# EAGLE design DAU_Kupplung_3phasig_V1_10 (EAGLE 6.1)
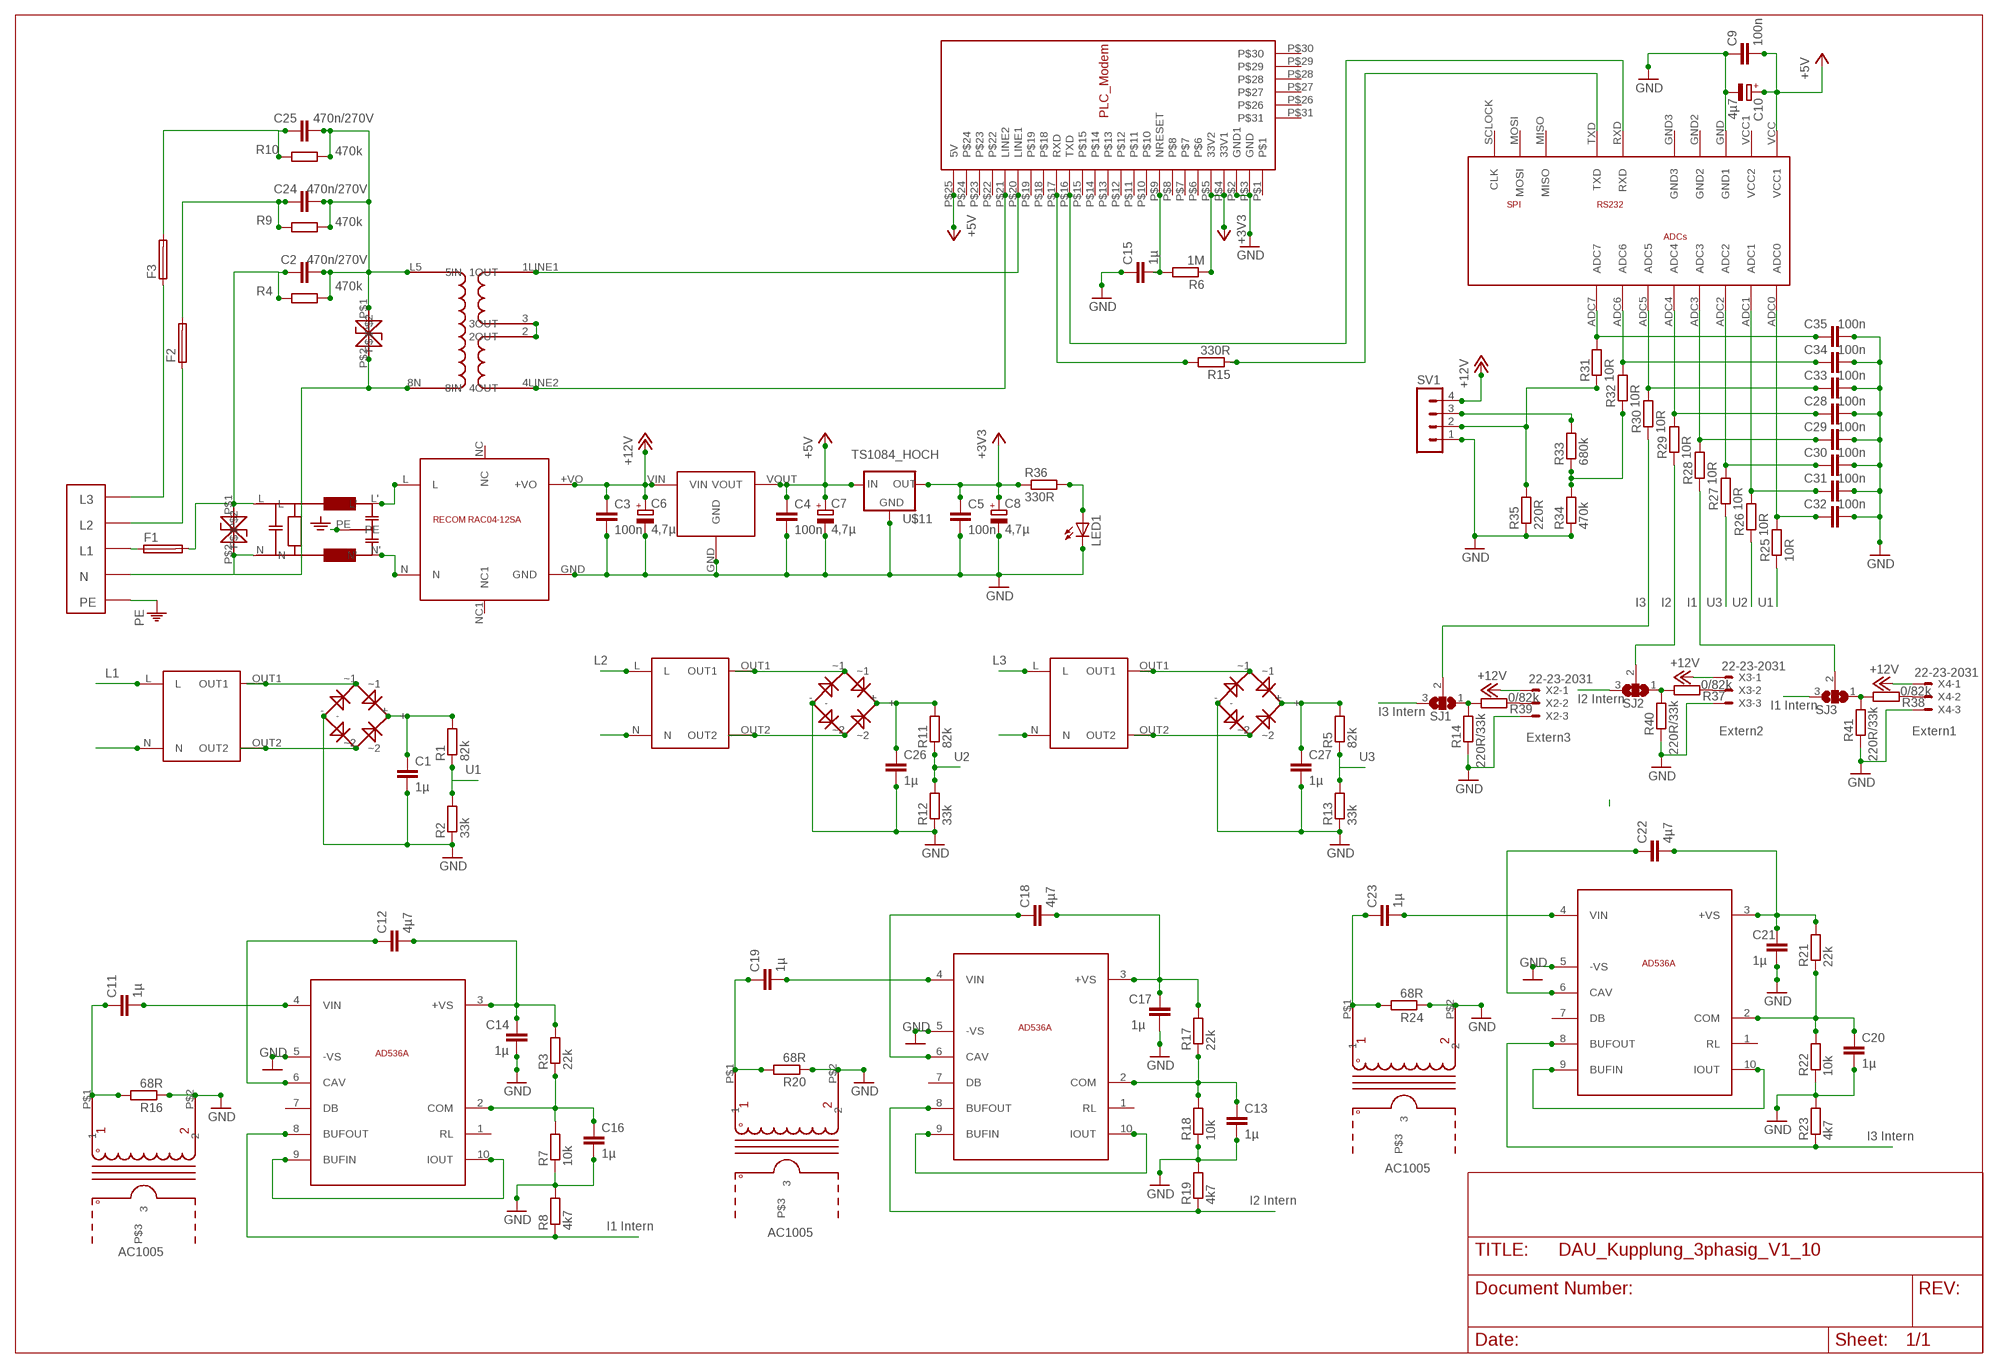
[diagram p0: schematic, sheet 1]

## Parts
AC1002_1  AC1010  [AC1010]
C1  1µ  C-EUC0805K  [C0805K]
C2  470n/270V  C-EU225-087X268  [C225-087X268]
C3  100n  C-EUC0805K  [C0805K]
C4  100n  C-EUC0805K  [C0805K]
C5  100n  C-EUC0805K  [C0805K]
C6  4,7µ  CPOL-EUE2.5-6  [E2,5-6]
C7  4,7µ  CPOL-EUE2.5-6  [E2,5-6]
C8  4,7µ  CPOL-EUE2.5-6  [E2,5-6]
C9  100n  C-EUC0805K  [C0805K]
C10  4µ7  CPOL-EUE2,5-6E  [E2,5-6E]
C11  1µ  C-EUC0805K  [C0805K]
C12  4µ7  C-EUC0805K  [C0805K]
C13  1µ  C-EUC0805K  [C0805K]
C14  1µ  C-EUC0805K  [C0805K]
C15  1µ  C-EUC0805K  [C0805K]
C16  1µ  C-EUC0805K  [C0805K]
C17  1µ  C-EUC0805K  [C0805K]
C18  4µ7  C-EUC0805K  [C0805K]
C19  1µ  C-EUC0805K  [C0805K]
C20  1µ  C-EUC0805K  [C0805K]
C21  1µ  C-EUC0805K  [C0805K]
C22  4µ7  C-EUC0805K  [C0805K]
C23  1µ  C-EUC0805K  [C0805K]
C24  470n/270V  C-EU225-087X268  [C225-087X268]
C25  470n/270V  C-EU225-087X268  [C225-087X268]
C26  1µ  C-EUC0805K  [C0805K]
C27  1µ  C-EUC0805K  [C0805K]
C28  100n  C-EUC0805K  [C0805K]
C29  100n  C-EUC0805K  [C0805K]
C30  100n  C-EUC0805K  [C0805K]
C31  100n  C-EUC0805K  [C0805K]
C32  100n  C-EUC0805K  [C0805K]
C33  100n  C-EUC0805K  [C0805K]
C34  100n  C-EUC0805K  [C0805K]
C35  100n  C-EUC0805K  [C0805K]
F1  TR5  [TR5]
F2  TR5  [TR5]
F3  TR5  [TR5]
LED1  LEDSQR2X5  [LED2X5]
P6KE300CA  P6KE300CA  TSV  [TSV]
R1  82k  R-EU_R0805  [R0805]
R2  33k  R-EU_R0805  [R0805]
R3  22k  R-EU_R0805  [R0805]
R4  470k  R-EU_0204/7  [0204/7]
R5  82k  R-EU_R0805  [R0805]
R6  1M  R-EU_R0805  [R0805]
R7  10k  R-EU_R0805  [R0805]
R8  4k7  R-EU_R0805  [R0805]
R9  470k  R-EU_0204/7  [0204/7]
R10  470k  R-EU_0204/7  [0204/7]
R11  82k  R-EU_R0805  [R0805]
R12  33k  R-EU_R0805  [R0805]
R13  33k  R-EU_R0805  [R0805]
R14  220R/33k  R-EU_R0805  [R0805]
R15  330R  R-EU_R0805  [R0805]
R16  68R  R-EU_0204/7  [0204/7]
R17  22k  R-EU_R0805  [R0805]
R18  10k  R-EU_R0805  [R0805]
R19  4k7  R-EU_R0805  [R0805]
R20  68R  R-EU_0204/7  [0204/7]
R21  22k  R-EU_R0805  [R0805]
R22  10k  R-EU_R0805  [R0805]
R23  4k7  R-EU_R0805  [R0805]
R24  68R  R-EU_0204/7  [0204/7]
R25  10R  R-EU_R0805  [R0805]
R26  10R  R-EU_R0805  [R0805]
R27  10R  R-EU_R0805  [R0805]
R28  10R  R-EU_R0805  [R0805]
R29  10R  R-EU_R0805  [R0805]
R30  10R  R-EU_R0805  [R0805]
R31  10R  R-EU_R0805  [R0805]
R32  10R  R-EU_R0805  [R0805]
R33  680k  R-EU_R0805  [R0805]
R34  470k  R-EU_R0805  [R0805]
R35  220R  R-EU_R0805  [R0805]
R36  330R  R-EU_R0805  [R0805]
R37  0/82k  R-EU_R0805  [R0805]
R38  0/82k  R-EU_R0805  [R0805]
R39  0/82k  R-EU_R0805  [R0805]
R40  220R/33k  R-EU_R0805  [R0805]
R41  220R/33k  R-EU_R0805  [R0805]
SJ1  SJ2WW  [SJ_2W]
SJ2  SJ2WW  [SJ_2W]
SJ3  SJ2WW  [SJ_2W]
SV1  MA04-1  [MA04-1]
TSV2  TSV  [TSV]
U$1  RECOM_RAC04_12SA  [RAC04_12SA]
U$2  SICHERHEITSTRAFO  [TRAFO_0,35VA]
U$3  ADUC831_MINIMUM  [ADUC_MINIMUM]
U$4  MODEMSTECKER  [MODEM_FUSS]
U$5  PLC_UEBERTRAGER_V2  [PLC-UEBERTRAGER_V2]
U$7  AC1010  [AC1010]
U$8  RECTIFIER  [RECTIFIER]
U$10  RECOM_785_05  [RECOM785X]
U$11  TS1084_HOCH  [TS1084_HOCH]
U$12  AD536  [TO100_10PIN]
U$13  AD536  [TO100_10PIN]
U$14  AC1010  [AC1010]
U$15  AD536  [TO100_10PIN]
U$16  SICHERHEITSTRAFO  [TRAFO_0,35VA]
U$17  RECTIFIER  [RECTIFIER]
U$18  SICHERHEITSTRAFO  [TRAFO_0,35VA]
U$19  RECTIFIER  [RECTIFIER]
U$20  NETZFILTER_05_A  [NETZFILTER]
X1  CONNECTO_5_POL  [CONNECTOR_5_POL]
X2  22-23-2031  [22-23-2031]
X3  22-23-2031  [22-23-2031]
X4  22-23-2031  [22-23-2031]

## Nets
+3V3: C5.1 C8.+ R6.1 R36.1 U$4.P$4(33V1) U$4.P$5(33V2) U$11.OUT
+5V: C4.1 C7.+ C9.2 C10.+ U$3.VCC(VCC1) U$4.P$25(5V) U$10.VOUT U$11.IN
+12V: C3.1 C6.+ SV1.4 U$1.+VO U$10.VIN X2.1 X3.1 X4.1
ADC0: C32.1 R25.2 U$3.ADC0
ADC1: C31.1 R26.2 U$3.ADC1
ADC2: C30.1 R27.2 U$3.ADC2
ADC3: C29.1 R28.2 U$3.ADC3
ADC4: C28.1 R29.2 U$3.ADC4
ADC5: C33.1 R30.2 U$3.ADC5
GND: AC1002_1.P$2 C1.2 C3.2 C4.2 C5.2 C6.- C7.- C8.- C9.1 C10.- C13.2 C14.1 C15.1 C16.2 C17.1 C20.2 C21.2 C26.2 C27.2 C28.2 C29.2 C30.2 C31.2 C32.2 C33.2 C34.2 C35.2 LED1.K(C) R2.1 R7.1 R8.2 R12.1 R13.1 R14.1 R16.1 R18.1 R19.2 R20.1 R22.1 R23.2 R24.1 R34.1 R35.1 R40.1 R41.1 SV1.1 U$1.GND U$3.GND(GND1) U$4.P$2(GND1) U$4.P$3(GND) U$7.P$2 U$8.- U$10.GND U$11.GND U$12.5(-VS) U$13.5(-VS) U$14.P$2 U$15.5(-VS) U$17.- U$19.- X2.3 X3.3 X4.3
I1: R28.1 SJ3.2
I1INTERN: R8.1 SJ3.3 U$13.8(BUFOUT)
I2: R29.1 SJ2.2
I2INTERN: R19.1 SJ2.3 U$12.8(BUFOUT)
I3: R30.1 SJ1.2
I3INTERN: R23.1 SJ1.3 U$15.8(BUFOUT)
L1: C2.1 F1.2 P6KE300CA.P$1 R4.2 U$2.L U$20.L
L2: C24.1 F2.2 R9.2 U$16.L
L3: C25.1 F3.2 R10.2 U$18.L
N: P6KE300CA.P$2 TSV2.P$2 U$2.N U$5.8N(8IN) U$16.N U$18.N U$20.N X1.P$4
N$1: R15.2 U$4.P$17(RXD)
N$2: AC1002_1.P$1 C11.1 R16.2
N$3: C11.2 U$13.4(VIN)
N$4: U$2.OUT1 U$8.~1
N$5: U$4.P$20(LINE1) U$5.1LINE1(1OUT)
N$6: U$13.9(BUFIN) U$13.10(IOUT)
N$7: C1.1 R1.2 U$8.+
N$8: C35.1 R31.2 U$3.ADC7
N$9: U$2.OUT2 U$8.~2
N$10: C26.1 R11.2 U$17.+
N$11: U$16.OUT1 U$17.~1
N$12: U$16.OUT2 U$17.~2
N$13: U$4.P$21(LINE2) U$5.4LINE2(4OUT)
N$14: R15.1 U$3.TXD
N$15: U$3.RXD U$4.P$16(TXD)
N$16: U$1.L U$20.L'
N$17: C16.1 R3.1 R7.2 U$13.2(COM)
N$18: C12.2 C14.2 R3.2 U$13.3(+VS)
N$19: LED1.A R36.2
N$20: C15.2 R6.2 U$4.P$9(NRESET)
N$21: C12.1 U$13.6(CAV)
N$22: C19.1 R20.2 U$7.P$1
N$23: C19.2 U$12.4(VIN)
N$24: U$12.9(BUFIN) U$12.10(IOUT)
N$25: C34.1 R32.2 U$3.ADC6
N$26: C2.2 C24.2 C25.2 R4.1 R9.1 R10.1 TSV2.P$1 U$5.L5(5IN)
N$27: C13.1 R17.1 R18.2 U$12.2(COM)
N$28: C17.2 C18.2 R17.2 U$12.3(+VS)
N$29: C18.1 U$12.6(CAV)
N$30: C23.1 R24.2 U$14.P$1
N$31: C23.2 U$15.4(VIN)
N$32: U$15.9(BUFIN) U$15.10(IOUT)
N$33: U$5.2(2OUT) U$5.3(3OUT)
N$34: C27.1 R5.2 U$19.+
N$35: U$18.OUT1 U$19.~1
N$36: U$18.OUT2 U$19.~2
N$37: R33.2 SV1.3
N$38: C20.1 R21.1 R22.2 U$15.2(COM)
N$39: C21.1 C22.2 R21.2 U$15.3(+VS)
N$40: C22.1 U$15.6(CAV)
N$41: U$1.N U$20.N'
N$42: R37.2 R40.2 SJ2.1
N$43: R37.1 X3.2
N$45: R14.2 R39.2 SJ1.1
N$46: F1.1 X1.P$3
N$47: F2.1 X1.P$2
N$48: F3.1 X1.P$1
N$49: R32.1 R33.1 R34.2
N$50: R31.1 R35.2 SV1.2
N$53: R39.1 X2.2
N$54: R38.2 R41.2 SJ3.1
N$55: R38.1 X4.2
PE: U$20.PE X1.P$5
U1: R1.1 R2.2 R25.1
U2: R11.1 R12.2 R26.1
U3: R5.1 R13.2 R27.1
Unconnected: AC1002_1.P$3 U$1.NC U$1.NC1 U$3.GND2 U$3.GND3 U$3.MISO U$3.MOSI U$3.SCLOCK(CLK) U$3.VCC1(VCC2) U$4.P$1 U$4.P$6 U$4.P$7 U$4.P$8 U$4.P$10 U$4.P$11 U$4.P$12 U$4.P$13 U$4.P$14 U$4.P$15 U$4.P$18 U$4.P$19 U$4.P$22 U$4.P$23 U$4.P$24 U$4.P$26 U$4.P$27 U$4.P$28 U$4.P$29 U$4.P$30 U$4.P$31 U$7.P$3 U$12.1(RL) U$12.7(DB) U$13.1(RL) U$13.7(DB) U$14.P$3 U$15.1(RL) U$15.7(DB)

## Notes on the sheet
- L3
- L2
- L1
- N
- PE | I3 | I2 | I1 | U3 | U2 | U1
- L2 | L3
- L1
- I2 Intern
- I1 Intern
- I3 Intern
- Extern2 | Extern1
- Extern3
- U2 | U3
- U1
- I3 Intern
- AC1005
- I2 Intern
- I1 Intern
- AC1005
- AC1005

## Library data of the parts
AC1002_1 U$7 U$14 = ADS:AC1010
C1-C5 C9 C11-C35 = resistor:C-EU: CAPACITOR, European symbol
C6-C8 = resistor:CPOL-EU: POLARIZED CAPACITOR, European symbol
C10 = rcl:CPOL-EU: POLARIZED CAPACITOR, European symbol
F1-F3 = fuse:TR5: FUSE Wickmann; OC_FARNELL: unknown; OC_NEWARK: unknown
LED1 = led:LED: LED OSRAM: - CHIPLED LG R971, LG N971, LY N971, LG Q971, LY Q971, LO R971, LY R971 LH N974, LH R974 LS Q976, LO Q976, LY Q976 LO Q996 - Hyper CHIPLED LW Q18S LB Q993, LB Q99A, LB R99A - SideLED LS A670, LO A670, LY A670, LG A670, LP A670 LB A673, LV A673, LT A673, LW A673 LH A674 LY A675 LS A676, LA A676, LO A676, LY A676, LW A676 LS A679, LY A679, LG A679 - Hyper Micro SIDELED® LS Y876, LA Y876, LO Y876, LY Y876 LT Y87S - SmartLED LW L88C, LW L88S LB L89C, LB L89S, LG L890 LS L89K, LO L89K, LY L89K LS L896, LA L896, LO L896, LY L896 - TOPLED LS T670, LO T670, LY T670, LG T670, LP T670 LSG T670, LSP T670, LSY T670, LOP T670, LYG T670 LG T671, LOG T671, LSG T671 LB T673, LV T673, LT T673, LW T673 LH T674 LS T676, LA T676, LO T676, LY T676, LB T676, LH T676, LSB T676, LW T676 LB T67C, LV T67C, LT T67C, LS T67K, LO T67K, LY T67K, LW E67C LS E67B, LA E67B, LO E67B, LY E67B, LB E67C, LV E67C, LT E67C LW T67C LS T679, LY T679, LG T679 LS T770, LO T770, LY T770, LG T770, LP T770 LB T773, LV T773, LT T773, LW T773 LH T774 LS E675, LA E675, LY E675, LS T675 LS T776, LA T776, LO T776, LY T776, LB T776 LHGB T686 LT T68C, LB T68C - Hyper Mini TOPLED® LB M676 - Mini TOPLED Santana® LG M470 LS M47K, LO M47K, LY M47K Source: http://www.osram.convergy.de LUXEON: - LUMILED® LXK2-PW12-R00, LXK2-PW12-S00, LXK2-PW14-U00, LXK2-PW14-V00 LXK2-PM12-R00, LXK2-PM12-S00, LXK2-PM14-U00 LXK2-PE12-Q00, LXK2-PE12-R00, LXK2-PE12-S00, LXK2-PE14-T00, LXK2-PE14-U00 LXK2-PB12-K00, LXK2-PB12-L00, LXK2-PB12-M00, LXK2-PB14-N00, LXK2-PB14-P00, LXK2-PB14-Q00 LXK2-PR12-L00, LXK2-PR12-M00, LXK2-PR14-Q00, LXK2-PR14-R00 LXK2-PD12-Q00, LXK2-PD12-R00, LXK2-PD12-S00 LXK2-PH12-R00, LXK2-PH12-S00 LXK2-PL12-P00, LXK2-PL12-Q00, LXK2-PL12-R00 Source: www.luxeon.com KINGBRIGHT: KA-3528ASYC Source: www.kingbright.com
P6KE300CA TSV2 = ADS:TSV
R1-R41 = resistor:R-EU_: RESISTOR, European symbol
SJ1-SJ3 = jumper:SJ2W: SMD solder JUMPER
SV1 = con-lstb:MA04-1: PIN HEADER; OC_FARNELL: unknown; OC_NEWARK: unknown
U$1 = ADS:RECOM_RAC04_12SA
U$2 U$16 U$18 = ADS:SICHERHEITSTRAFO
U$3 = ADS_ADUCBoards:ADUC831_MINIMUM
U$4 = ADS:MODEMSTECKER
U$5 = ADS1:PLC_UEBERTRAGER_V2
U$8 U$17 U$19 = ADS:RECTIFIER
U$10 = ADS:RECOM_785_05
U$11 = ADS:TS1084_HOCH
U$12 U$13 U$15 = ADS:AD536
U$20 = ADS:NETZFILTER_05_A
X1 = ADS:CONNECTO_5_POL
X2-X4 = con-molex:22-23-2031: .100" (2.54mm) Center Header - 3 Pin; MF: MOLEX; MPN: 22-23-2031; OC_FARNELL: 1462950; OC_NEWARK: 30C0862

## Board
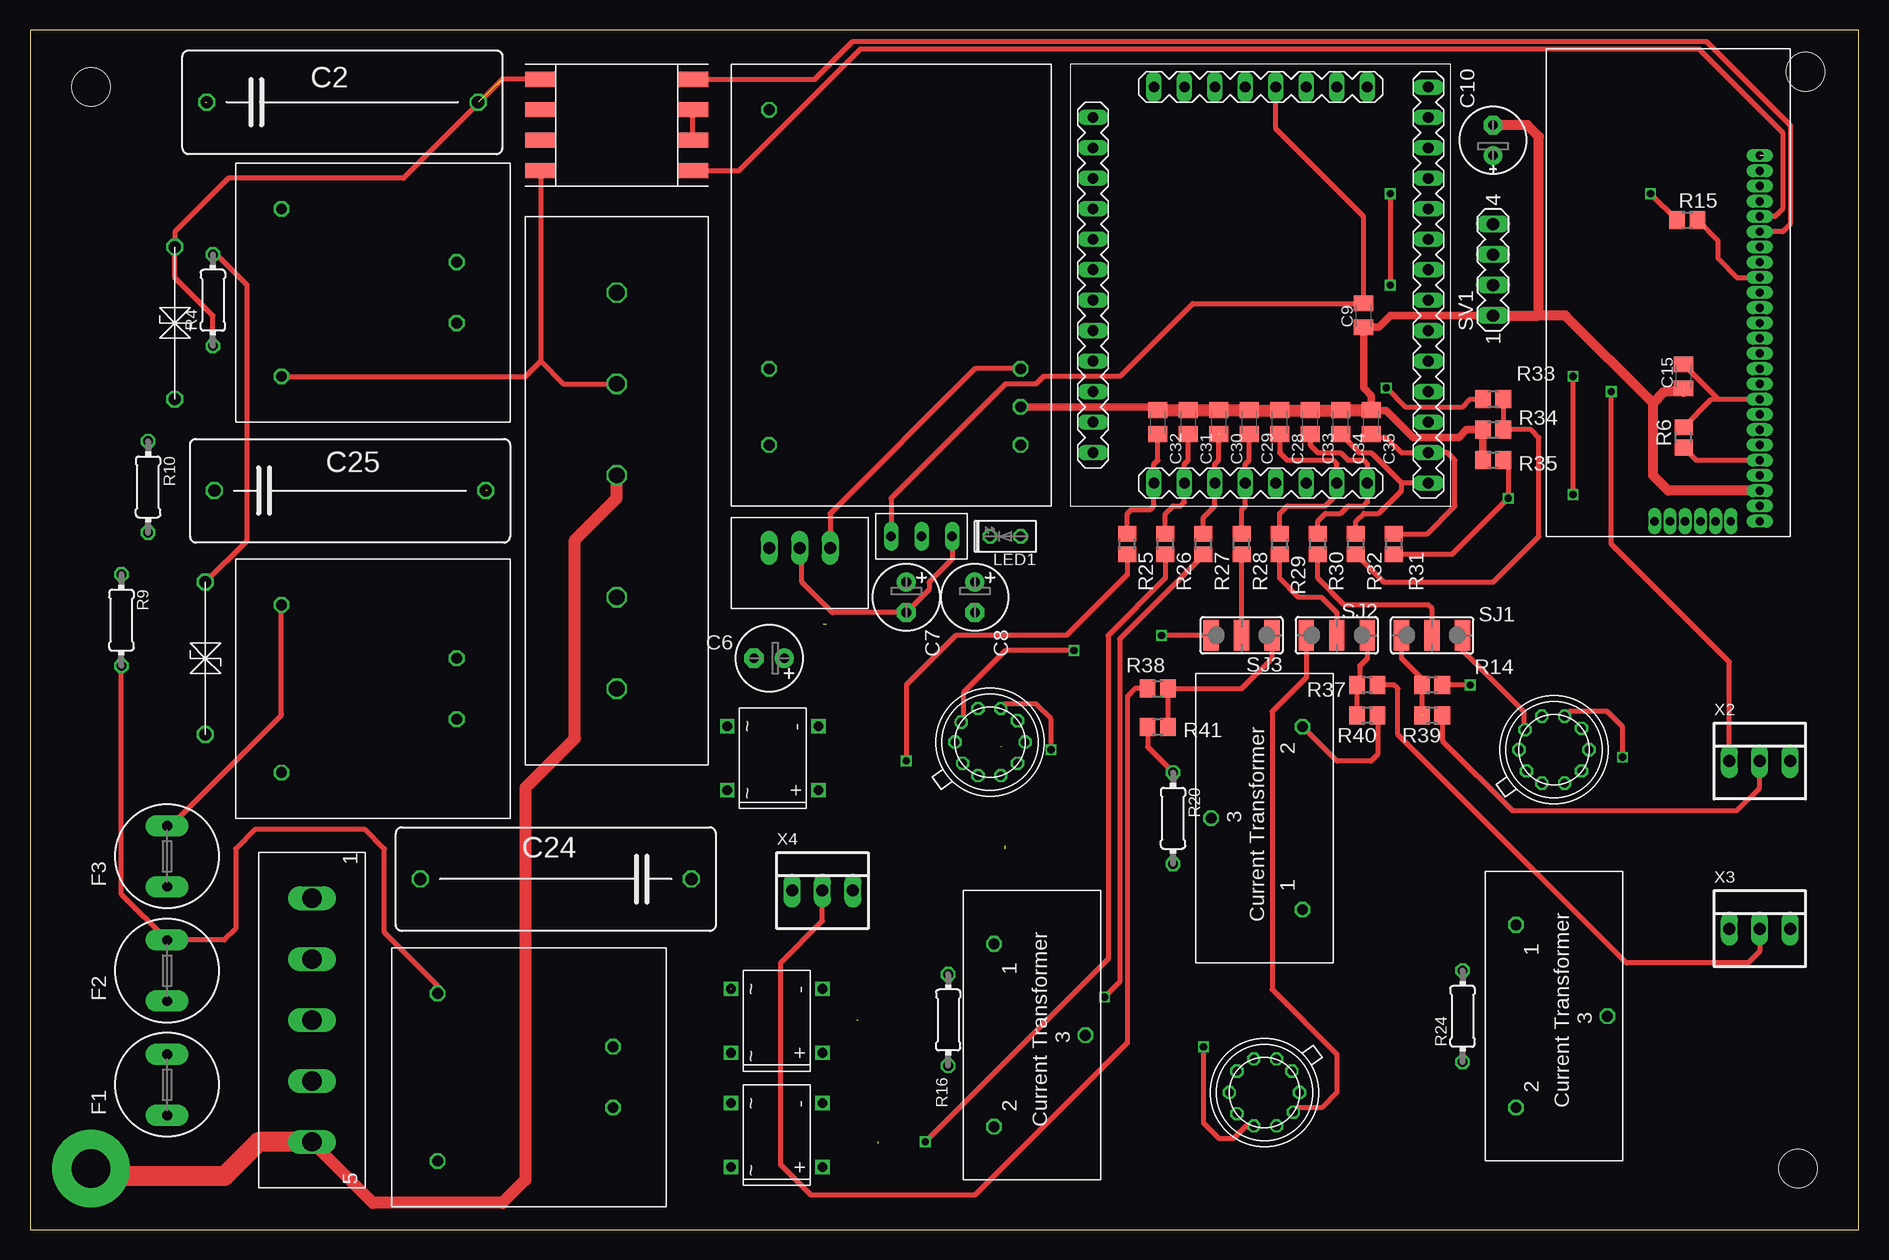
[diagram p1: board, top side]
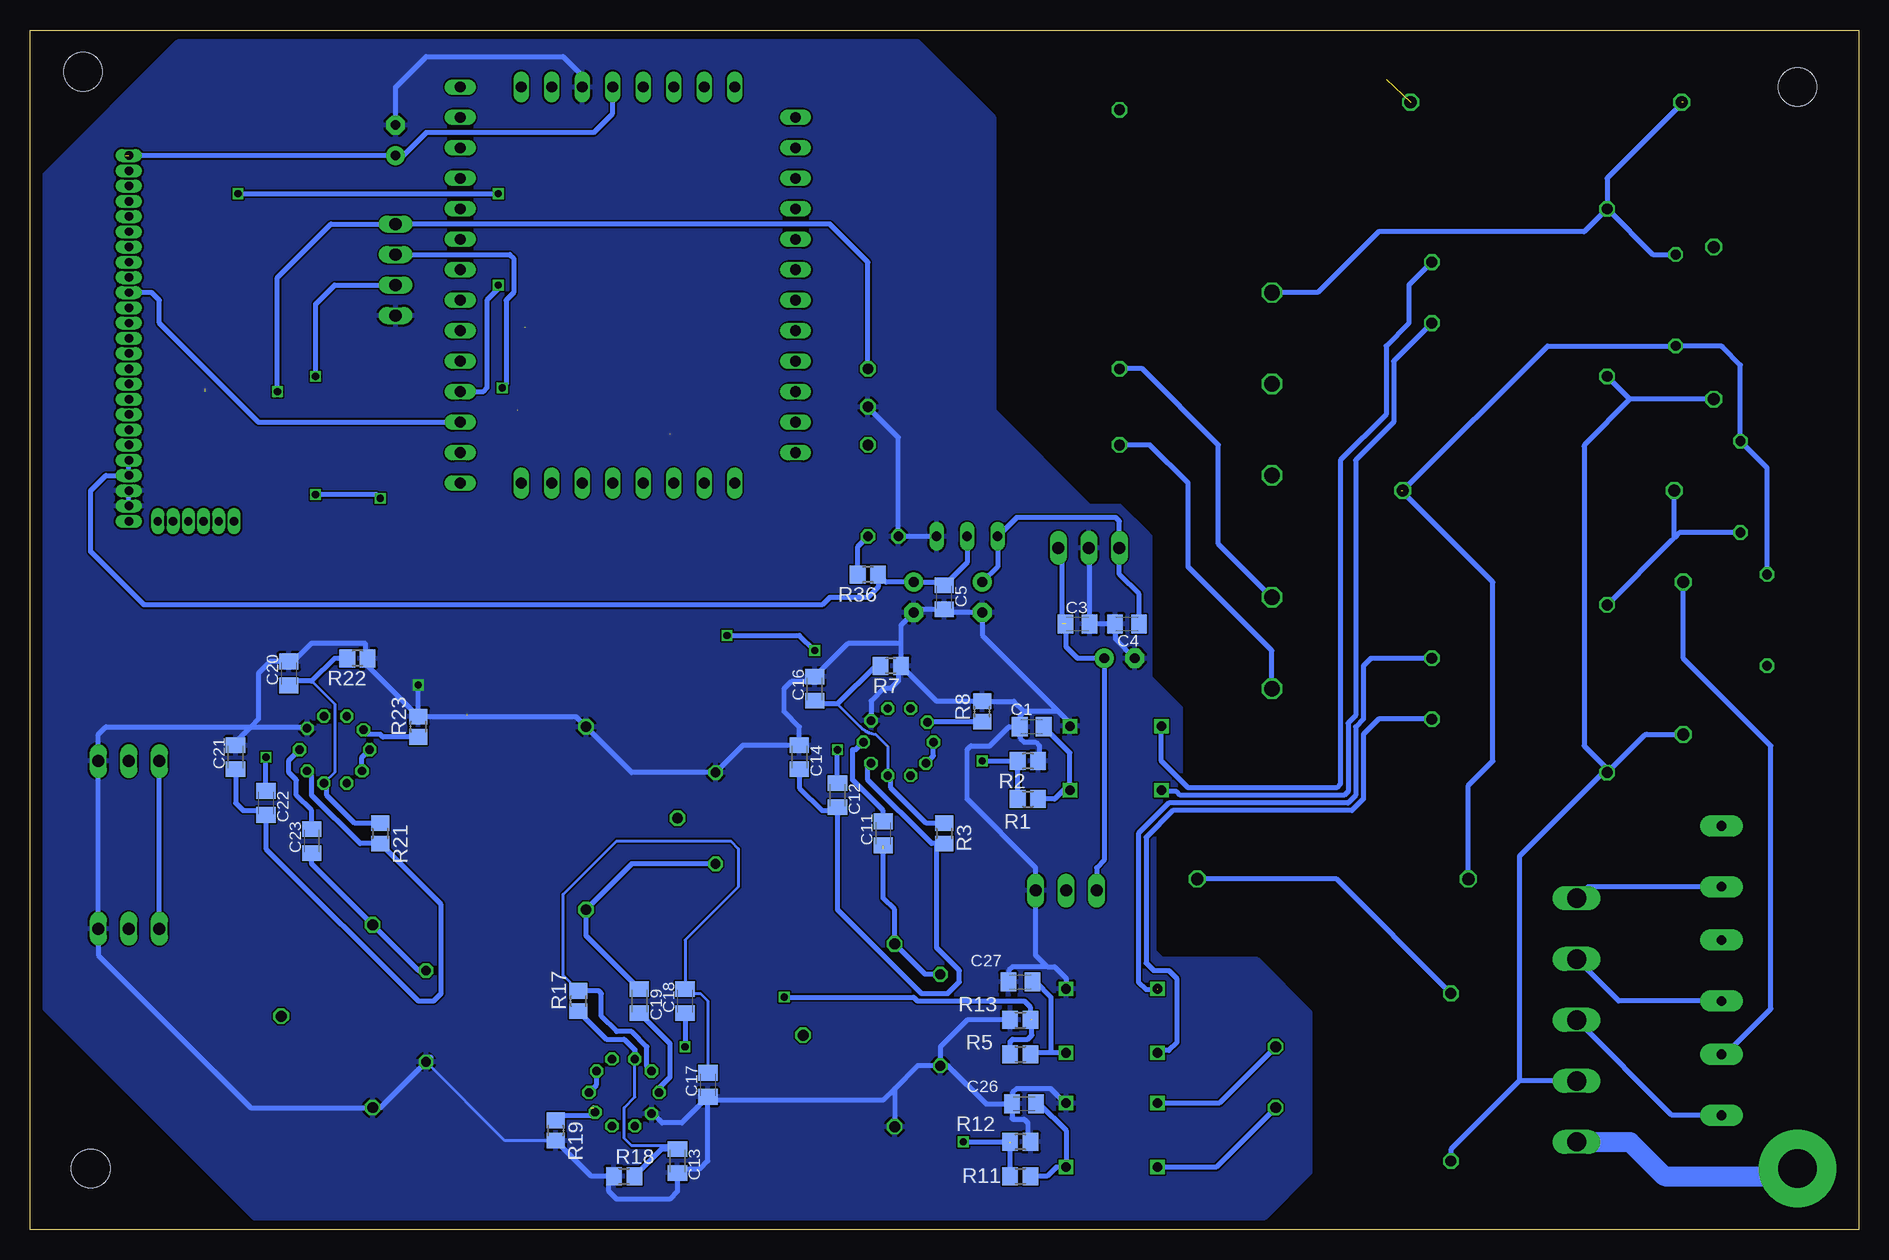
[diagram p2: board, bottom side, seen from below]

Size 152.38 x 100 mm. Coordinates in mm from the lower left corner, seen from the top.
Outline: 0,0 152.38,0 152.38,100 0,100 0,0
Copper layers (1+2*15+16): Top 0.035mm / dielectric 0.38mm / Route2 0.035mm / dielectric 0.71mm / Route15 0.035mm / dielectric 0.38mm / Bottom 0.035mm
Design rules: minimum track width 0.15mm, minimum drill 0.3mm, track to track 0.15mm, track to pad 0.15mm, pad to pad 0.15mm, via to via 0.15mm, smd to smd 0.15mm, copper to edge 0.3mm, drill to drill 0.2mm, minimum pad ring 0.2mm, minimum via ring 0.15mm, stop-mask expansion 0.075mm, vias tented up to drill 0mil, thermal gap 0.2mm
Holes 3.2 mm at 147.96,96.52 147.32,5.08 5.08,95.25

### Footprints (pad centres in the part's own frame; a part is rotated, then mirrored left to right if it is on the bottom)
AC1010 = drill 0.9 octagon: P$1 20.32,8.89; P$2 5.08,8.89; P$3 12.7,1.27
C0805K = smd 1.3 x 1.6: 1 -1,0; 2 1,0
C225-087X268 = drill 1.016 octagon: 1 -11.303,0; 2 11.303,0
E2,5-6 = drill 0.813 pad 1.6: + -1.27,0 | drill 0.813 pad 1.6 octagon: - 1.27,0
E2,5-6E = drill 0.813 pad 1.575: + -1.27,0 | drill 0.813 pad 1.575 octagon: - 1.27,0
TR5 = drill 0.813 pad 1.778 long: 1 -2.54,0; 2 2.54,0
LED2X5 = drill 0.813 octagon: A -1.27,0; K 1.27,0
TSV = drill 1 octagon: P$1 -5.08,0; P$2 7.62,0
R0805 = smd 1.3 x 1.5: 1 -0.85,0; 2 0.85,0
0204/7 = drill 0.813 octagon: 1 -3.81,0; 2 3.81,0
SJ_2W = smd 1.27 x 2.54: 1 -2.54,0; 2 0,0; 3 2.54,0
MA04-1 = drill 1.016 long: 1 -3.81,0; 2 -1.27,0; 3 1.27,0; 4 3.81,0
RAC04_12SA = drill 0.9 octagon: +VO 25.4,24.13; GND 28.575,24.13; L 31.75,3.175; N 25.4,3.175; NC 3.81,3.175; NC1 31.75,24.13
TRAFO_0,35VA = drill 0.9 octagon: L 3.81,17.78; N 3.81,3.81; OUT1 18.415,13.335; OUT2 18.415,8.255
ADUC_MINIMUM = drill 0.9 long: ADC0 -9.207,-16.51; ADC1 -6.668,-16.51; ADC2 -4.128,-16.51; ADC3 -1.587,-16.51; ADC4 6.032,-16.51; ADC5 8.572,-16.51; ADC6 13.652,-16.51; ADC7 13.652,-13.97; ALE -14.287,6.35; DAC0 0.953,-16.51; DAC1 3.493,-16.51; GND 3.493,16.51; GND2 -4.128,16.51; GND3 -6.668,16.51; INT0 13.652,-6.35; MISO 13.652,-3.81; MOSI 13.652,11.43; P00 -14.287,3.81; P01 -14.287,1.27; P02 -14.287,-1.27; P03 -14.287,-3.81; P04 -14.287,-6.35; P05 -14.287,-8.89; P06 -14.287,-11.43; P07 -14.287,-13.97; P20 13.652,13.97; P21 13.652,16.51; P22 8.572,16.51; P23 6.032,16.51; P24 -9.207,16.51; P25 -14.287,13.97; P34 13.652,-1.27; P35 13.652,1.27; P36 13.652,3.81; P37 13.652,6.35; PWM0 -14.287,11.43; PWM1 -14.287,8.89; RXD 13.652,-11.43; SCLOCK 13.652,8.89; TXD 13.652,-8.89; VCC 0.953,16.51; VCC1 -1.587,16.51
MODEM_FUSS = drill 0.7 pad 0.813 long: P$1 -20.32,-8.89; P$2 -19.05,-8.89; P$3 -17.78,-8.89; P$4 -16.51,-8.89; P$5 -15.24,-8.89; P$6 -13.97,-8.89; P$7 -12.7,-8.89; P$8 -11.43,-8.89; P$9 -10.16,-8.89; P$10 -8.89,-8.89; P$11 -7.62,-8.89; P$12 -6.35,-8.89; P$13 -5.08,-8.89; P$14 -3.81,-8.89; P$15 -2.54,-8.89; P$16 -1.27,-8.89; P$17 0,-8.89; P$18 1.27,-8.89; P$19 2.54,-8.89; P$20 3.81,-8.89; P$21 5.08,-8.89; P$22 6.35,-8.89; P$23 7.62,-8.89; P$24 8.89,-8.89; P$25 10.16,-8.89; P$29 -20.32,-3.937; P$30 -20.32,-5.207; P$31 -20.32,-6.477 | drill 0.7 pad 0.61 long: P$26 -20.32,-0.127; P$27 -20.32,-1.397; P$28 -20.32,-2.667
PLC-UEBERTRAGER_V2 = smd 2.54 x 1.27: 1LINE1 6.35,3.81; 2 6.35,1.27; 3 6.35,-1.27; 4LINE2 6.35,-3.81; 6NC -6.35,1.27; 7NC -6.35,-1.27; 8N -6.35,-3.81; L5 -6.35,3.81
RECTIFIER = drill 0.8 square: + 6.858,7.62; - 1.524,7.62; ~1 1.524,0; ~2 6.858,0
RECOM785X = drill 1 long: GND 0,2.54; VIN -2.54,2.54; VOUT 2.54,2.54
TS1084_HOCH = drill 0.8 long: GND 0,0; IN 5.08,0; OUT 2.54,0
TO100_10PIN = drill 0.7 octagon: 1 2.794,-1.016; 2 2.794,0.889; 3 1.778,2.286; 4 0,2.921; 5 -1.778,2.286; 6 -2.794,0.889; 7 -2.794,-1.016; 8 -1.651,-2.413; 9 0,-2.921; 10 1.778,-2.286
NETZFILTER = drill 1.3 octagon: L 6.35,7.62; L' 39.37,7.62; N 13.97,7.62; N' 31.75,7.62; PE 21.59,7.62
CONNECTOR_5_POL = drill 1.6 long: P$1 3.81,4.445; P$2 8.89,4.445; P$3 13.97,4.445; P$4 19.05,4.445; P$5 24.13,4.445
22-23-2031 = drill 1 long: 1 -2.54,0; 2 0,0; 3 2.54,0

### Placement (x,y rotation side)
AC1002_1  89.22,3.49 90 top
C1  68.9,41.91 180 bottom
C2  26.04,93.98 0 top
C3  65.09,50.48 0 bottom
C4  60.96,50.48 180 bottom
C5  76.2,52.7 270 bottom
C6  61.59,47.62 180 top
C7  73.03,52.7 270 top
C8  78.74,52.7 270 top
C9  111.12,76.2 90 top
C10  121.92,90.81 90 top
C11  81.28,33.02 90 bottom
C12  85.09,36.2 270 bottom
C13  98.42,5.71 270 bottom
C14  88.27,39.37 270 bottom
C15  137.79,71.12 90 top
C16  87,45.09 90 bottom
C17  95.89,12.06 90 bottom
C18  97.79,19.05 90 bottom
C19  101.6,19.05 270 bottom
C20  130.81,46.35 90 bottom
C21  135.25,39.37 90 bottom
C22  132.72,35.56 270 bottom
C23  128.91,32.38 90 bottom
C24  43.81,29.21 180 top
C25  26.67,61.59 0 top
C26  69.53,10.48 180 bottom
C27  69.85,20.64 180 bottom
C28  104.14,67.31 90 top
C29  101.6,67.31 90 top
C30  99.06,67.31 90 top
C31  96.52,67.31 90 top
C32  93.98,67.31 90 top
C33  106.68,67.31 90 top
C34  109.22,67.31 90 top
C35  111.76,67.31 90 top
F1  11.43,12.06 90 top
F2  11.43,21.59 90 top
F3  11.43,31.11 90 top
LED1  81.28,57.78 180 top
P6KE300CA  14.61,48.9 270 top
R1  69.22,35.88 0 bottom
R2  69.22,39.05 180 bottom
R3  76.2,33.02 270 bottom
R4  15.24,77.47 90 top
R5  69.85,14.61 0 bottom
R6  137.79,66.04 90 top
R7  80.64,46.99 180 bottom
R8  73.03,43.18 90 bottom
R9  7.62,50.8 270 top
R10  9.84,61.91 270 top
R11  69.85,4.45 0 bottom
R12  69.85,7.3 180 bottom
R13  69.85,17.46 0 bottom
R14  116.84,45.4 180 top
R15  138.11,84.14 0 top
R16  76.52,17.46 90 top
R17  106.68,19.05 90 bottom
R18  102.87,4.45 0 bottom
R19  108.58,8.26 270 bottom
R20  95.25,34.29 270 top
R21  123.19,33.02 270 bottom
R22  125.09,47.62 180 bottom
R23  120.02,41.91 90 bottom
R24  119.38,17.78 90 top
R25  91.44,57.15 90 top
R26  94.61,57.15 90 top
R27  97.79,57.15 90 top
R28  100.97,57.15 90 top
R29  104.14,57.15 90 top
R30  107.31,57.15 90 top
R31  113.67,57.15 90 top
R32  110.49,57.15 90 top
R33  121.92,69.22 180 top
R34  121.92,66.67 0 top
R35  121.92,64.14 0 top
R36  82.55,54.61 180 bottom
R37  111.44,45.4 180 top
R38  93.98,45.09 0 top
R39  116.84,42.86 180 top
R40  111.44,42.86 180 top
R41  93.98,41.91 0 top
SJ1  116.84,49.53 0 top
SJ2  108.9,49.53 180 top
SJ3  100.97,49.53 180 top
SV1  121.92,80.01 90 top
TSV2  12.06,76.83 270 top
U$1  58.42,97.16 270 top
U$2  17.14,67.31 0 top
U$3  102.87,78.74 0 top
U$4  135.25,79.38 90 top
U$5  48.9,92.08 0 top
U$7  97.16,46.99 270 top
U$8  58.1,43.5 270 top
U$10  64.14,59.37 180 top
U$11  76.83,57.78 180 top
U$12  102.87,11.43 90 top
U$13  80.01,40.64 270 top
U$14  132.72,5.08 90 top
U$15  127,40.01 270 top
U$16  30.16,1.91 0 top
U$17  58.42,12.06 270 top
U$18  17.14,34.29 0 top
U$19  58.42,21.59 270 top
U$20  41.27,84.45 270 top
X1  19.05,31.43 270 top
X2  144.15,39.05 0 top
X3  144.15,25.08 0 top
X4  66.04,28.26 0 top

### Tracks (layer width: path | path; a pad name or v marks a point on that pad's centre or on a via)
+3V3
  Top 0.406: R6.1 138.85,64.14 U$4.P$5
  Bottom 0.406: U$11.OUT 74.3,55.61 C5.1 76.47,53.98 C8.+ 81.06,53.98 R36.1 81.7,53.55 82.55,52.7 85.72,52.7 86.36,52.07 142.88,52.07 147.32,56.52 147.32,61.59 146.05,62.87 U$4.P$4 U$4.P$5
+5V  (1 unrouted)
  Top 0.406: U$11.IN 71.75,60.96 81.28,70.48 83.82,70.48 84.45,71.12 90.81,71.12 96.89,77.2 C9.2 | C9.2 111.12,84.45 103.82,91.76 U$3.VCC | C9.2 111.12,77.15
  Bottom 0.406: C4.1 59.96,52.98 61.59,54.61 U$10.VOUT 61.59,59.05 61.91,59.37 70.17,59.37 U$11.IN 71.75,55.24 C7.+ | U$3.VCC 103.82,93.03 105.41,91.44 119.38,91.44 121.28,89.53 C10.+ 144.46,89.53
+12V  (via drill 0.6)  (1 unrouted)
  Top 0.406: U$1.+VO 78.74,71.75 66.67,59.69 U$10.VIN | X2.1 141.6,47.31 131.76,57.15 v131.76,69.85
  Bottom 0.406: U$10.VIN 66.41,56.24 66.41,50.53 66.36,50.48 | U$1.+VO 82.55,80.64 85.72,83.82 SV1.4 127.32,83.82 131.76,79.38 v131.76,69.85 | C3.1 66.04,50.44 66.04,48.58 65.09,47.62 C6.+ 62.87,30.8 63.5,30.16 X4.1 | X3.1 X2.1
ADC0
  Top 0.406: R25.2 91.44,59.69 91.76,60.01 93.34,60.01 93.66,60.33 U$3.ADC0 93.66,63.82 93.98,64.14 C32.1
ADC1
  Top 0.406: R26.2 94.61,59.69 95.25,60.33 95.89,60.33 96.2,60.64 U$3.ADC1 96.2,63.82 96.52,64.14 C31.1
ADC2  (1 unrouted)
  Top 0.406: R27.2 97.79,59.37 98.74,60.33 U$3.ADC2 98.74,63.82 99.06,64.14 99.06,66.36
ADC3
  Top 0.406: R28.2 100.97,60.01 101.28,60.33 U$3.ADC3 101.28,63.82 101.6,64.14 C29.1
ADC4
  Top 0.406: C28.1 104.14,64.77 104.78,64.14 108.58,64.14 108.9,63.82 U$3.ADC4 108.9,61.28 107.95,60.33 104.78,60.33 104.14,59.69 R29.2
ADC5
  Top 0.406: C33.1 106.68,65.41 107.31,64.77 109.22,64.77 109.86,64.14 111.12,64.14 111.44,63.82 U$3.ADC5 111.44,60.64 111.12,60.33 109.86,60.33 109.22,59.69 107.95,59.69 107.31,59.05 R30.2
GND  (via drill 0.6)  (3 unrouted)
  Top 0.406: U$10.GND 64.31,56.34 64.31,53.99 66.87,51.44 C7.- 74.93,53.34 74.93,53.98 76.83,55.88 U$11.GND | C32.2 93.71,68.58 | C15.1 137.43,70.48 | R41.1 93.13,40.22 R20.1 | v120.02,45.4 R14.1 | R40.1 112.29,39.59 111.76,39.05 108.9,39.05 U$7.P$2
  Top 0.61: 93.71,68.58 U$1.GND | R34.1 120.97,66.67 | 120.97,66.67 119.7,66.67 119.06,66.04 115.25,66.04 113.03,68.26 111.76,68.26 111.76,69.53 111.12,70.17 111.12,75.25 112.39,75.25 113.35,76.2 SV1.1 | R35.1 121.07,66.57 120.97,66.67
  Top 0.813: U$4.P$3 136.53,61.59 135.25,62.87 135.25,68.9 | 137.79,69.85 136.21,69.85 135.25,68.9 | 135.25,68.9 127.95,76.2 125.73,76.2 | 121.6,76.2 SV1.1 125.73,76.2 | 125.73,76.2 125.73,91.12 124.78,92.08 C10.-
  Top 1.016: C32.2 96.47,68.31 96.52,68.26 | C31.2 C30.2 C29.2 101.6,68.26 104.09,68.26 C28.2 104.14,68.26 106.63,68.26 C33.2 106.68,68.26 109.17,68.26 C34.2 C35.2
  Bottom 0.254: R19.2 112.81,7.41 R24.1 | C17.1 95.61,10.79
  Bottom 0.406: C10.- 121.92,95.25 119.38,97.79 107.95,97.79 106.36,96.2 U$3.GND | U$4.P$2 U$4.P$3 | U$11.GND LED1.K 80.01,66.04 U$1.GND | C21.2 135.25,40.64 133.99,41.91 | 133.99,41.91 129.41,41.91 U$15.5 | 133.99,41.91 133.35,42.55 133.35,46.35 132.35,47.35 C20.2 130.44,47.35 128.91,48.9 124.46,48.9 124.46,47.84 R22.1 124.25,46.99 R23.2 | R23.2 106.89,42.76 U$7.P$2 102.23,38.1 R20.1 92.98,40.37 C14.1 88.27,41.91 89.53,43.18 89.53,45.09 88.9,45.72 87.36,45.72 C16.2 84.19,48.9 79.8,48.9 | R7.1 76.83,44.03 R8.2 70.38,44.03 69.53,43.18 | R7.1 79.8,48.9 | 79.8,48.9 79.8,50.38 C8.- 78.47,51.7 C5.2 75.93,51.44 C7.- 73.03,49.53 66.67,43.18 | 118.96,14.39 R24.1 123.19,10.16 U$14.P$2 133.99,10.16 146.69,22.86 146.69,24.45 | U$12.5 100.46,9.65 99.69,8.89 98.06,8.89 C17.1 95.89,5.71 96.52,5.08 98.06,5.08 C13.2 98.42,3.17 99.06,2.54 103.5,2.54 104.14,3.17 104.14,4.45 | R18.1 105.62,4.45 108.17,6.99 108.58,6.99 | R7.1 80.01,46.77 80.01,45.72 80.64,45.09 81.28,45.09 82.3,44.07 U$13.5 | R16.1 78.42,13.65 80.33,11.75 | 80.33,11.75 AC1002_1.P$2 | 70.85,17.61 R13.1 74.3,17.46 76.52,15.24 R16.1 | 67.63,21.91 70.48,21.91 70.8,21.59 70.8,20.68 C27.2 | U$17.- 66.1,10.54 67.31,11.75 70.17,11.75 70.48,11.43 70.48,10.53 C26.2 | C26.2 70.53,9.26 70.48,9.21 69.53,9.21 69.22,8.89 69.22,7.52 R12.1 | 67.63,21.91 68.58,22.86 X4.3 68.58,30.16 74.3,35.88 74.3,40.01 73.98,40.32 72.39,40.32 70.8,41.91 C1.2 | 95.61,10.79 81.28,10.79 80.33,11.75 | R16.1 75.88,13.65 72.71,10.48 C26.2 | U$8.- 65.72,42.23 66.67,43.18 | 66.67,43.18 69.53,43.18 | 69.53,43.18 69.85,42.86 69.85,40.96 69.53,40.64 68.58,40.64 68.26,40.32 68.26,39.16 R2.1
  Bottom 0.406: X3.3 X2.3 146.69,41.27 146.05,41.91 133.99,41.91 | R23.2 v120.02,45.4 | C6.- 61.91,49.21 61.91,50.44 C4.2 C3.2 64.09,56.78 U$10.GND | 67.63,21.91 66.99,21.91 66.04,20.95 U$19.-
  pour Bottom: 45.72,16.51 45.72,4.76 49.53,0.95 133.67,0.95 151.13,18.41 151.13,87.95 140.02,99.06 78.42,99.06 72.07,92.71 72.07,68.26 64.14,60.33 61.59,60.33 59.37,58.1 59.05,57.78 59.05,46.04 56.52,43.5 56.52,34.92 58.42,33.02 58.74,32.7 58.74,23.18 58.1,22.54 50.16,22.54 45.72,18.1
I1
  Top 0.406: SJ3.2 R28.1
I1INTERN  (via drill 0.6)
  Top 0.406: 77.22,42.29 U$13.8 77.79,42.48 77.79,44.77 81.28,48.26 v87,48.26 | SJ3.3 v94.3,49.53
  Bottom 0.406: R8.1 77.56,42.33 U$13.8 | v94.3,49.53 88.27,49.53 v87,48.26
I2
  Top 0.406: R29.1 104.14,54.29 105.73,52.7 107.63,52.7 108.9,51.44 SJ2.2
I2INTERN  (1 unrouted)
  Top 0.406: SJ2.3 106.36,46.04 103.5,43.18 103.5,20 108.9,14.61 108.9,11.43 107.63,10.16 105.66,10.16 U$12.8
  Bottom 0.406: R19.1 108.17,9.53 105.41,9.53 105.41,10.16
I3
  Top 0.406: SJ1.2 116.84,51.75 116.52,52.07 109.54,52.07 107.31,54.29 R30.1
I3INTERN
  Top 0.406: SJ1.3 119.38,48.26 124.46,43.18 124.46,41.78 U$15.8
  Bottom 0.406: R23.1 122.97,41.06 123.19,41.27 124.21,41.27 U$15.8
L1  (1 unrouted)
  Top 0.406: P6KE300CA.P$1 18,57.38 arc45 18.1,57.6 18.1,78.74 15.65,81.19 arc45 15.43,81.28 R4.2
  Bottom 0.406: 14.61,93.98 20.95,87.63 U$2.L | U$2.L 17.14,81.28 R4.2 | U$2.L 22.86,83.19 40.01,83.19 45.09,78.11 U$20.L | F1.2 11.11,14.61 7.3,18.41 7.3,40.32 14.61,47.62 P6KE300CA.P$1
L2
  Top 0.406: R9.2 7.62,27.94 F2.2 16.19,24.13 17.14,25.08 17.14,31.75 18.73,33.34 27.94,33.34 29.53,31.75 29.53,24.77 33.97,20.32 U$16.L
  Bottom 0.406: U$16.L 43.5,29.21 C24.1
L3
  Top 0.406: U$18.L 20.95,42.99 arc-45 20.86,42.77 11.75,33.66 F3.2
  Bottom 0.406: U$18.L 15.56,57.47 15.37,57.66 | 15.37,57.66 C25.1 | R10.2 14.92,58.1 15.37,57.66
N
  Top 0.406: U$5.8N 42.55,72.39 | 42.55,72.39 44.45,70.48 U$20.N | U$2.N 41.27,71.12 42.55,72.39 | 33.97,6.03 U$16.N
  Bottom 0.406: TSV2.P$2 19.05,69.22 | 19.05,69.22 U$2.N | U$18.N 17.87,41.18 arc45 17.65,41.27 P6KE300CA.P$2 | 19.05,69.22 22.77,65.5 arc-45 22.86,65.27 22.86,40.32 21.05,38.51 arc45 20.95,38.29 U$18.N | X1.P$4 28.26,12.38 | 28.26,12.38 33.97,6.67 U$16.N | U$18.N 21.27,38.1 28.26,31.11 28.26,12.38
N$1
  Top 0.406: R15.2 140.65,82.45 140.65,80.96 142.24,79.38 U$4.P$17
N$2  (1 unrouted)
  Bottom 0.406: R16.2 77.79,21.27 AC1002_1.P$1 80.33,26.67 81.28,27.62 81.28,31.75
N$3
  Bottom 0.406: C11.2 81.28,34.92 83.82,37.47 83.82,40.01 83.57,40.01 U$13.4
N$4
  Bottom 0.406: U$2.OUT1 37.47,78.74 37.47,75.56 39.37,73.66 39.37,67.94 43.18,64.14 43.18,37.15 43.5,36.83 55.88,36.83 58.1,39.05 U$8.~1
N$5
  Top 0.406: U$5.1LINE1 65.41,95.89 68.58,99.06 139.7,99.06 146.69,92.08 146.69,83.82 146.05,83.19 U$4.P$20
N$6
  Bottom 0.406: U$13.10 77.09,39.5 U$13.9
N$7
  Bottom 0.406: C1.1 65.72,39.73 U$8.+ 66.23,36.64 66.99,35.88 R1.2
N$8
  Top 0.406: C35.1 112.03,66.04 113.03,66.04 114.3,64.77 U$3.ADC7 118.11,64.77 118.75,64.14 118.75,60.33 116.42,58 R31.2
N$9
  Bottom 0.406: U$2.OUT2 38.73,72.39 38.73,67.31 41.91,64.14 41.91,42.86 42.55,42.23 42.55,36.51 42.86,36.2 56.52,36.2 56.83,36.51 58.1,36.51 U$8.~2
N$10
  Bottom 0.406: R11.2 67.63,4.45 66.86,5.21 U$17.+ 66.04,8.26 68.26,10.48 C26.1
N$11
  Bottom 0.406: U$16.OUT1 53.28,10.54 U$17.~1
N$12
  Bottom 0.406: U$16.OUT2 53.53,5.21 U$17.~2
N$13
  Top 0.406: U$5.4LINE2 59.05,88.27 69.22,98.42 139.06,98.42 146.05,91.44 146.05,85.09 145.41,84.45 U$4.P$21
N$14  (via drill 0.6)
  Top 0.406: R15.1 v135.04,86.36 | v113.35,86.36 v113.35,78.74
  Bottom 0.406: v113.35,78.74 113.35,78.42 114.3,77.47 114.3,70.17 114.62,69.85 U$3.TXD | v135.04,86.36 v113.35,86.36
N$15
  Bottom 0.406: U$4.P$16 142.24,78.11 141.6,77.47 141.6,75.56 133.35,67.31 U$3.RXD
N$16
  Bottom 0.406: U$20.L' 48.9,48.26 55.88,55.24 55.88,62.23 59.05,65.41 U$1.L
N$17  (1 unrouted)
  Bottom 0.254: 80.9,40.26 U$13.2 | 85.09,43.81 83.19,41.91 arc-37 81.92,41.27 80.96,40.32
  Bottom 0.406: R7.2 81.92,46.99 85.09,43.81 86.72,43.81 C16.1 | R3.1 77.69,33.87 80.64,36.83 80.64,37.59 U$13.2
N$18
  Bottom 0.406: C14.2 88.27,36.83 86.36,34.92 85.36,34.92 C12.2 85.09,26.67 78.11,19.68 75.88,19.68 74.93,20.64 74.93,21.59 76.83,23.5 76.83,32.17 | R3.2 76.83,32.17 | 76.83,32.17 77.25,32.17 82.55,37.47 82.55,38.61 U$13.3
N$19
  Bottom 0.406: R36.2 83.4,56.94 LED1.A
N$20
  Top 0.406: C15.2 140.7,69.22 | 140.7,69.22 U$4.P$9 | R6.2 140.12,69.22 140.7,69.22
N$21  (via drill 0.6)
  Top 0.406: v85.09,40.01 85.09,42.55 83.82,43.81 81.28,43.81 U$13.6
  Bottom 0.406: C12.1 v85.09,40.01
N$22
  Bottom 0.406: R20.2 102.23,30.48 U$7.P$1 106.05,24.5 C19.1
N$23
  Bottom 0.406: C19.2 99.06,15.51 99.06,12.7 99.95,11.81 U$12.4
N$24
  Bottom 0.406: U$12.9 105.16,12.06 U$12.10
N$25
  Top 0.406: C34.1 110.76,64.77 111.76,64.77 114.14,62.39 114.3,62.23 | R32.2 110.49,59.05 111.12,59.69 112.39,59.69 114.3,61.59 114.3,62.23 | U$3.ADC6 114.3,62.23
N$26  (2 unrouted)
  Top 0.406: U$5.L5 39.37,95.89 31.11,87.63 16.51,87.63 12.06,83.19 TSV2.P$1 12.06,79.38 15.24,76.2 R4.1
  Bottom 0.406: 37.47,61.59 C25.2 25.91,73.66 R4.1 11.56,73.66 arc45 11.34,73.57 9.84,72.07 R10.1 7.62,63.5 R9.1 | C24.2 32.51,37.02 30.48,39.05 30.48,53.98 38.1,61.59
N$27
  Bottom 0.254: C13.1 98.69,6.99 102.23,6.99 102.87,7.62 102.87,10.16 101.98,11.05 U$12.2
  Bottom 0.406: R18.2 99.75,6.71 C13.1 | R17.1 104.36,15.88 102.87,15.88 101.98,14.99 U$12.2
N$28
  Bottom 0.254: R17.2 107.95,21.17 107.95,27.94 103.5,32.38 93.98,32.38 93.34,31.75 93.34,28.57 97.79,24.13 C18.2 | C18.2 97.79,19.68 | C18.2 97.42,19.68 96.52,19.68 95.89,19.05 C17.2
  Bottom 0.406: C18.2 98.16,19.68 | C17.2 96.03,13.21 | U$12.3 100.97,13.59 100.97,15.24 102.23,16.51 103.5,16.51 104.78,17.78 104.78,19.68 104.99,19.9 R17.2
N$29  (via drill 0.6)
  Top 0.406: v97.79,15.24 97.79,8.89 99.06,7.62 100.33,7.62 101.35,8.64 U$12.6
  Bottom 0.406: C18.1 v97.79,15.24
N$30
  Bottom 0.406: R24.2 120.02,21.59 U$14.P$1 128.91,30.48 C23.1
N$31
  Bottom 0.406: C23.2 128.91,34.92 130.18,36.2 130.18,37.47 130.81,38.1 130.81,39.12 U$15.4
N$32
  Bottom 0.406: U$15.10 124.71,39.37 U$15.9
N$33
  Top 0.406: U$5.3 U$5.2
N$34
  Bottom 0.406: U$19.+ 67.31,14.73 | 67.31,14.73 68.87,14.73 R5.2 | C27.1 68.58,20.64 67.31,19.37 67.31,14.73
N$35  (1 unrouted)
  Bottom 0.406: U$18.OUT1 40.64,47.62 41.27,46.99 41.27,42.55 41.91,41.91 41.91,36.2 42.55,35.56 57.47,35.56 60.01,33.02 60.01,20.64 59.37,20 58.42,20
N$36
  Bottom 0.406: U$18.OUT2 40.01,42.55 41.27,41.27 41.27,35.88 42.23,34.92 57.15,34.92 59.37,32.7 59.37,22.23 58.74,21.59 57.47,21.59 56.83,20.95 56.83,15.56 57.47,14.92 58.23,14.92 U$19.~2
N$37  (via drill 0.6)
  Top 0.406: v113.03,70.17 114.62,68.58 119.38,68.58 120.02,69.22 R33.2
  Bottom 0.406: SV1.3 112.39,81.28 112.08,80.96 112.08,78.11 112.71,77.47 112.71,70.48 v113.03,70.17
N$38
  Bottom 0.254: U$15.2 127,38.1 127,43.81 128.54,45.35 128.91,45.72
  Bottom 0.406: R21.1 125.31,33.87 127.64,36.2 127.64,36.96 U$15.2 | R22.2 127,47.62 128.91,45.72 130.44,45.72 C20.1
N$39
  Bottom 0.406: C21.1 135.25,35.56 134.62,34.92 133.08,34.92 C22.2 132.72,31.75 120.02,19.05 118.75,19.05 118.11,19.68 118.11,27.09 R21.2 124.88,32.17 128.91,36.2 128.91,37.85 U$15.3
N$40  (via drill 0.6)
  Top 0.406: v132.72,39.37 132.72,41.91 131.44,43.18 128.27,43.18 U$15.6
  Bottom 0.406: C22.1 v132.72,39.37
N$41
  Bottom 0.406: U$20.N' 53.34,57.15 53.34,65.41 59.69,71.75 U$1.N
N$42
  Top 0.406: R40.2 R37.2 110.81,45.62 110.81,46.99 111.44,47.62 SJ2.1
N$43
  Top 0.406: X3.2 144.15,23.18 143.19,22.23 133.03,22.23 113.98,41.27 113.98,45.09 113.67,45.4 R37.1
N$45  (1 unrouted)
  Top 0.406: SJ1.1 114.3,47.62 115.99,45.94 R14.2 115.99,42.97 115.89,42.86
N$46
  Bottom 0.406: F1.1 15.56,9.53 X1.P$3
N$47
  Bottom 0.406: F2.1 20,19.05 X1.P$2
N$48
  Bottom 0.406: F3.1 22.54,28.57 X1.P$1
N$49
  Top 0.406: R32.1 112.81,53.98 121.92,53.98 125.73,57.78 125.73,66.04 125.09,66.67 R34.2 R33.1
N$50  (via drill 0.6)
  Top 0.406: R31.1 118.53,56.3 v123.19,60.96 123.19,63.72 R35.2 | v128.59,61.28 v128.59,71.12
  Bottom 0.406: v123.19,60.96 123.51,61.28 v128.59,61.28 | v128.59,71.12 128.59,77.15 127,78.74 SV1.2
N$52  (via drill 3.2 pad 6.45)
  other vias: 5.08,5.08
N$53
  Top 0.406: R39.1 117.69,40.74 123.51,34.92 142.24,34.92 144.15,36.83 X2.2
N$54
  Top 0.406: SJ3.1 103.5,47.62 100.97,45.09 R38.2 R41.2
N$55
  Top 0.406: R38.1 92.08,45.09 91.44,44.45 91.44,15.56 78.74,2.86 65.09,2.86 62.55,5.4 62.55,22.23 66.04,25.72 X4.2
PE
  Top 1.016: U$20.PE 48.9,60.96 45.4,57.47 45.4,40.96 41.27,36.83 41.27,4.13 39.37,2.22 28.57,2.22 X1.P$5
  Top 1.676: X1.P$5 19.05,7.3 16.19,4.45 7.62,4.45
  Bottom 1.676: X1.P$5 19.05,7.3 16.19,4.45 7.62,4.45
U1  (via drill 0.6)
  Top 0.406: R25.1 91.44,54.61 86.36,49.53 77.15,49.53 73.03,45.4 v73.03,39.05
  Bottom 0.406: R1.1 70.06,38.42 | 70.06,38.42 R2.2 | v73.03,39.05 70.7,39.05 70.06,38.42
U2  (via drill 0.6)  (1 unrouted)
  Top 0.406: R26.1 94.61,54.29 89.85,49.53 89.85,22.54 v74.61,7.3
  Bottom 0.406: R11.1 70.7,7.2 70.8,7.3 | v74.61,7.3 R12.2
U3  (via drill 0.6)  (1 unrouted)
  Top 0.406: R27.1 97.79,56.2 90.81,49.21 90.81,20.64 v89.53,19.37
  Bottom 0.406: R5.1 70.7,15.66 70.48,15.88 69.22,15.88 68.9,16.19 68.9,17.46 | R13.2 69,18.52 69.53,19.05 78.42,19.05 78.74,19.37 v89.53,19.37